# EAGLE schematic sp6641-aek (EAGLE 6.2)
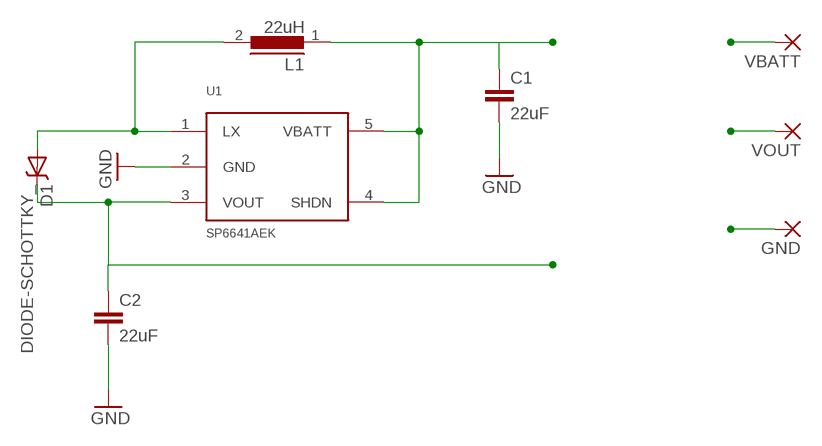
[diagram p0: schematic, sheet 1]

## Parts
C1  22uF  CAP1206  [1206]
C2  22uF  CAP1206  [1206]
D1  DIODE-SCHOTTKY_  [SMA-DIODE]
GND  WIREPADSMD2,54-5,08  [SMD2,54-5,08]
L1  22uH  DR73  [DR73]
U1  SP6641AEK  SP6641SP6641A/B  [SOT23-5]
VBATT  WIREPADSMD2,54-5,08  [SMD2,54-5,08]
VOUT  WIREPADSMD2,54-5,08  [SMD2,54-5,08]

## Nets
GND: C1.2 C2.2 GND.1(P) U1.2(GND)
N$2: D1.A L1.2 U1.1(LX)
VBATT: C1.1 L1.1 U1.4(SHDN) U1.5(VBATT) VBATT.1(P)
VOUT: C2.1 D1.C U1.3(VOUT) VOUT.1(P)

## Library data of the parts
C1 C2 = SparkFun:CAP: Capacitor Standard 0603 ceramic capacitor, and 0.1" leaded capacitor.
D1 = SparkFun:DIODE-SCHOTTKY
GND VBATT VOUT = wirepad:WIREPAD: Wire PAD connect wire on PCB
L1 = inductors:DR73: High Power Density, High Efficiency, Shielded Inductors Source: coiltronics_dr_series.pdf
U1 = Sipex Custom:SP6641